# EAGLE schematic io-pack-3-3 (EAGLE 7.5.0)
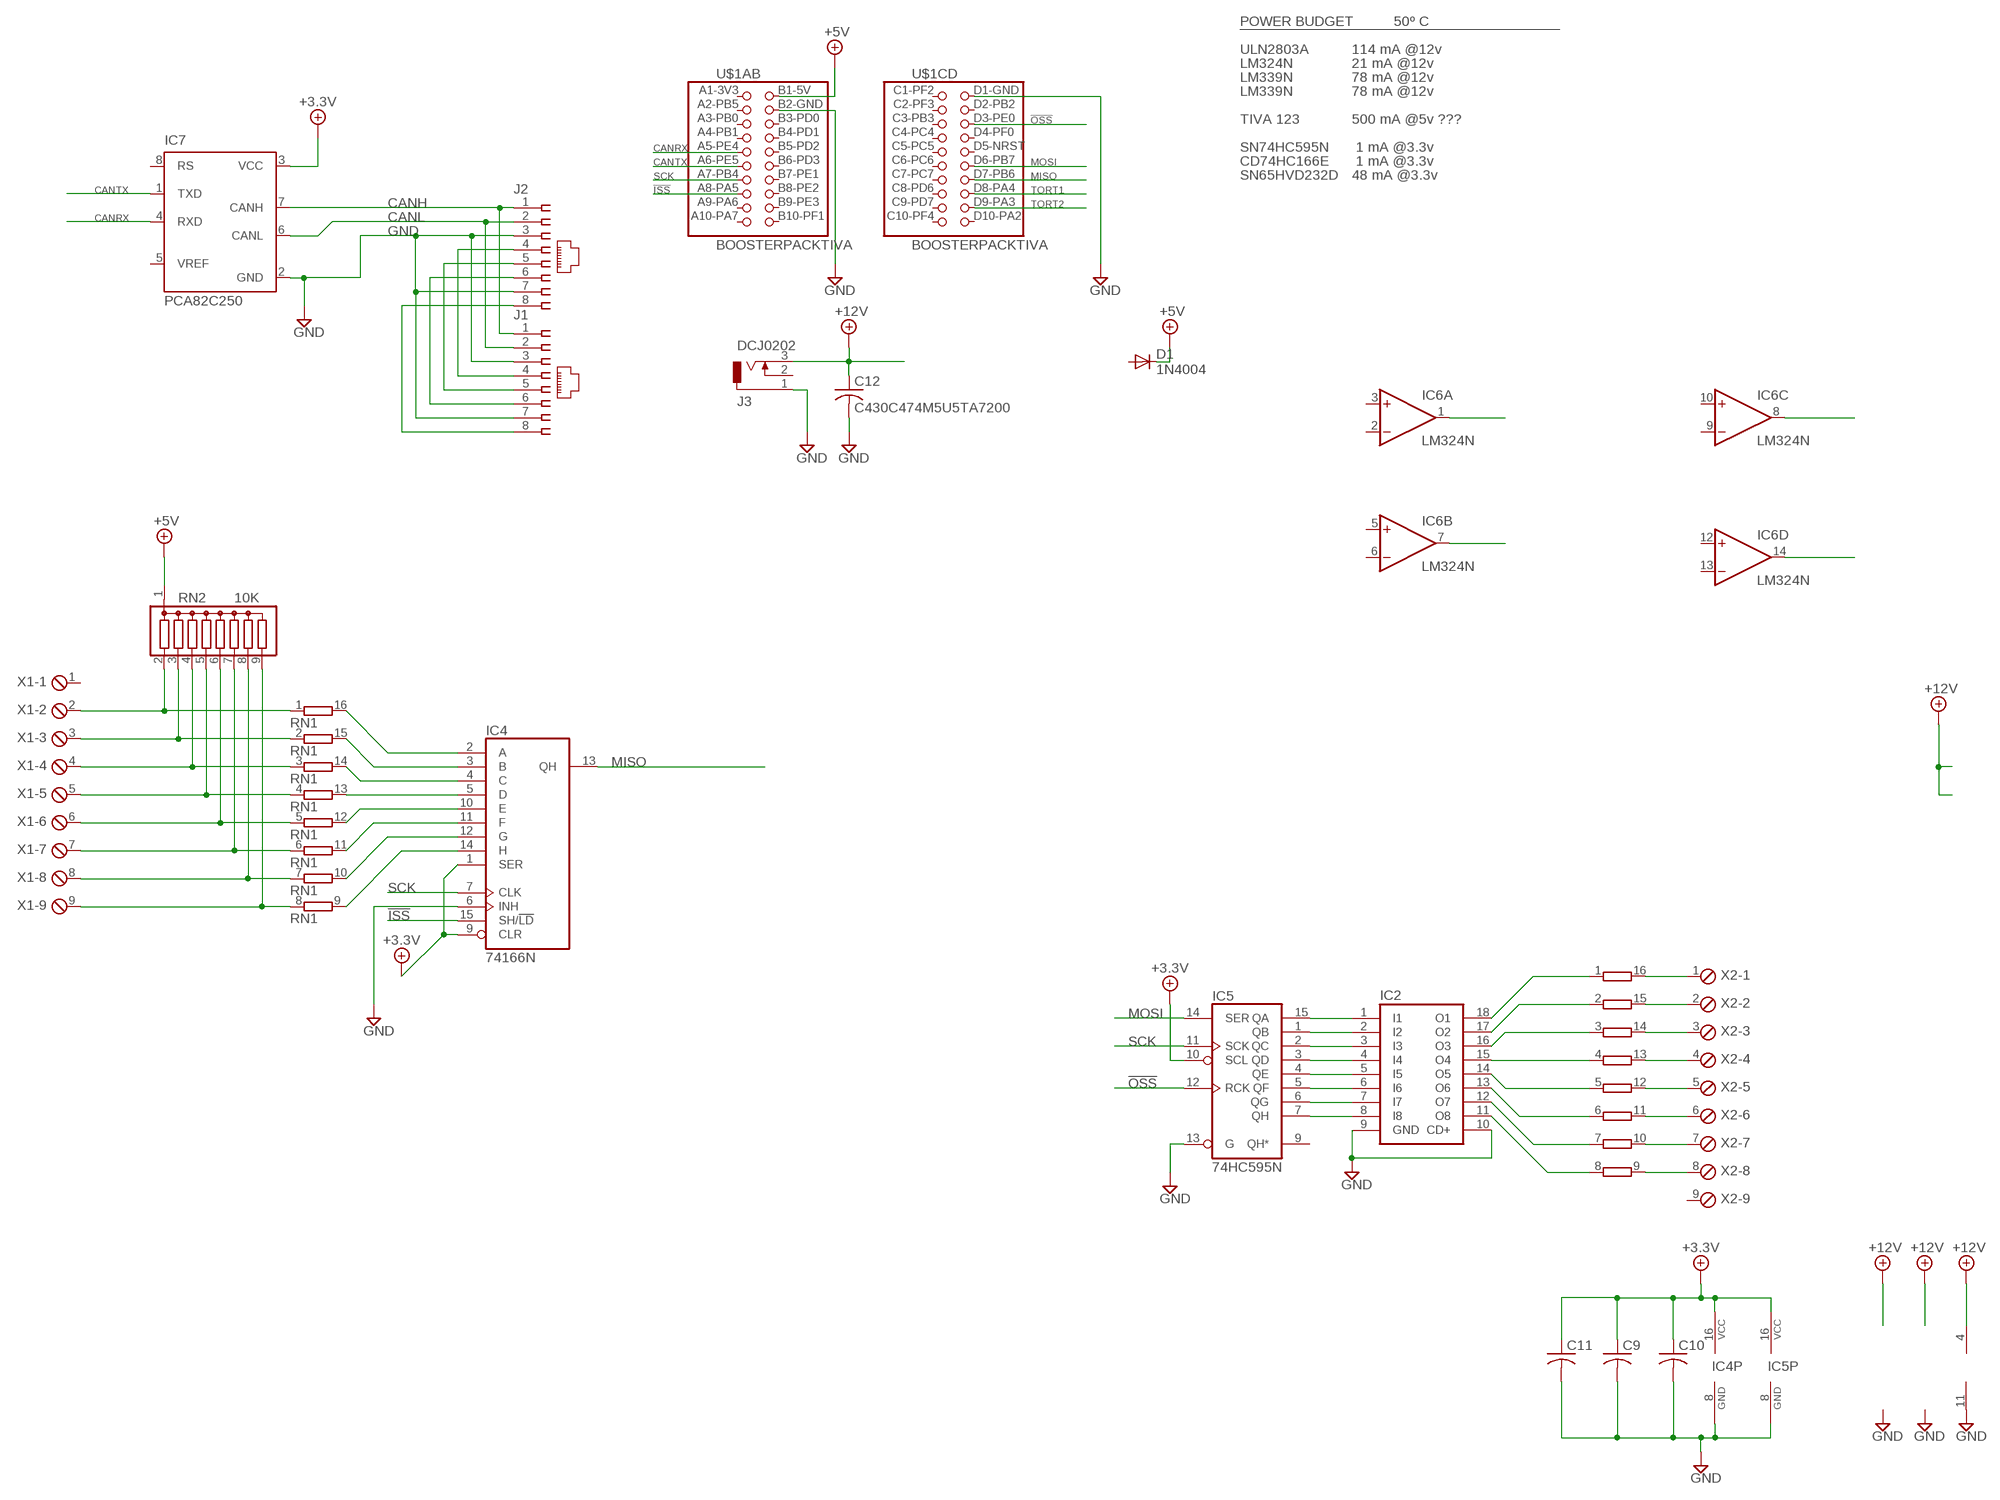
[diagram p0: schematic, sheet 1]

## Parts
C9  C-US050-025X075  [C050-025X075]
C10  C-US050-025X075  [C050-025X075]
C11  C-US050-025X075  [C050-025X075]
C12  C430C474M5U5TA7200  C-US075-032X103  [C075-032X103]
D1  1N4004  [DO41-10]
IC2  ULN2803A  [DIL18]
IC4  74166N  [DIL16]
IC5  74HC595N  74LS595N  [DIL16]
IC6  LM324N  [DIL14]
IC7  PCA82C250  [DIL08]
J1  555164-1  [555164-1]
J2  555164-1  [555164-1]
J3  DCJ0202  [DCJ0202]
RN1  8R-P  [DIL16]
RN2  10K  G08R  [SIL9]
RN3  8R-P  [DIL16]
U$1  BOOSTERPACKTIVA  [BOOSTERPACK-TIVA]
X1  MPT9  [9POL254]
X2  MPT9  [9POL254]

## Nets
!ISS: IC4.15(SH/!LD) U$1.A8-PA5
!OSS: IC5.12(RCK) U$1.D3-PE0
+3.3V: C9.1 C10.1 C11.1 IC4.1(SER) IC4.9(CLR) IC4.16(VCC) IC5.10(SCL) IC5.16(VCC) IC7.3(VCC)
+5V: D1.C RN2.1 U$1.B1-5V
+12V: C12.1 IC6.4(P:V+) J3.3
CANH: IC7.7(CANH) J1.1 J2.1
CANL: IC7.6(CANL) J1.2 J2.2
CANRX: IC7.4(RXD) U$1.A5-PE4
CANTX: IC7.1(TXD) U$1.A6-PE5
GND: C9.2 C10.2 C11.2 C12.2 IC2.9(GND) IC2.10(CD+) IC4.6(INH) IC4.8(GND) IC5.8(GND) IC5.13(G) IC6.11(P:V-) IC7.2(GND) J1.3 J1.7 J2.3 J2.7 J3.1 U$1.B2-GND U$1.D1-GND
MISO: IC4.13(QH) U$1.D7-PB6
MOSI: IC5.14(SER) U$1.D6-PB7
N$1: IC2.18(O1) RN3.1
N$2: IC2.17(O2) RN3.2
N$3: IC2.16(O3) RN3.3
N$4: J1.4 J2.4
N$5: J1.5 J2.5
N$6: J1.6 J2.6
N$7: IC2.15(O4) RN3.4
N$8: IC2.14(O5) RN3.5
N$9: IC2.13(O6) RN3.6
N$10: IC2.12(O7) RN3.7
N$11: IC2.11(O8) RN3.8
N$12: RN3.16 X2.1
N$13: RN3.15 X2.2
N$14: RN3.14 X2.3
N$15: RN3.13 X2.4
N$16: RN3.12 X2.5
N$17: RN3.11 X2.6
N$18: RN3.10 X2.7
N$19: RN3.9 X2.8
N$21: IC2.1(I1) IC5.15(QA)
N$22: IC2.2(I2) IC5.1(QB)
N$23: IC2.3(I3) IC5.2(QC)
N$24: IC2.4(I4) IC5.3(QD)
N$25: RN1.1 RN2.2 X1.2
N$26: RN1.2 RN2.3 X1.3
N$27: RN1.3 RN2.4 X1.4
N$28: RN1.4 RN2.5 X1.5
N$33: RN1.5 RN2.6 X1.6
N$34: RN1.6 RN2.7 X1.7
N$35: RN1.7 RN2.8 X1.8
N$36: RN1.8 RN2.9 X1.9
N$37: IC2.5(I5) IC5.4(QE)
N$38: IC2.6(I6) IC5.5(QF)
N$39: IC2.7(I7) IC5.6(QG)
N$40: IC2.8(I8) IC5.7(QH)
N$44: IC4.2(A) RN1.16
N$47: IC4.3(B) RN1.15
N$48: IC4.4(C) RN1.14
N$49: IC4.5(D) RN1.13
N$50: IC4.10(E) RN1.12
N$51: IC4.11(F) RN1.11
N$52: IC4.12(G) RN1.10
N$53: IC4.14(H) RN1.9
N$60: IC6.7(B:OUT)
N$63: IC6.14(D:OUT)
N$64: IC6.1(A:OUT)
N$65: IC6.8(C:OUT)
PWR_POS: J1.8 J2.8
SCK: IC4.7(CLK) IC5.11(SCK) U$1.A7-PB4
TORT1: U$1.D8-PA4
TORT2: U$1.D9-PA3
Unconnected: D1.A IC5.9(QH*) IC6.2(A:-IN) IC6.3(A:+IN) IC6.5(B:+IN) IC6.6(B:-IN) IC6.9(C:-IN) IC6.10(C:+IN) IC6.12(D:+IN) IC6.13(D:-IN) IC7.5(VREF) IC7.8(RS) J3.2 U$1.A1-3V3 U$1.A2-PB5 U$1.A3-PB0 U$1.A4-PB1 U$1.A9-PA6 U$1.A10-PA7 U$1.B3-PD0 U$1.B4-PD1 U$1.B5-PD2 U$1.B6-PD3 U$1.B7-PE1 U$1.B8-PE2 U$1.B9-PE3 U$1.B10-PF1 U$1.C1-PF2 U$1.C2-PF3 U$1.C3-PB3 U$1.C4-PC4 U$1.C5-PC5 U$1.C6-PC6 U$1.C7-PC7 U$1.C8-PD6 U$1.C9-PD7 U$1.C10-PF4 U$1.D2-PB2 U$1.D4-PF0 U$1.D5-NRST U$1.D10-PA2 X1.1 X2.9

## Notes on the sheet
- POWER BUDGET | 50º C
- ULN2803A | 114 mA @12v
- LM324N | 21 mA @12v
- LM339N | 78 mA @12v
- LM339N | 78 mA @12v
- TIVA 123 | 500 mA @5v ???
- SN74HC595N | 1 mA @3.3v
- CD74HC166E | 1 mA @3.3v
- SN65HVD232D | 48 mA @3.3v

## Library data of the parts
C9-C12 = rcl:C-US: CAPACITOR, American symbol
D1 = diode:1N4004: DIODE general purpose rectifier, 1 A
IC2 = uln-udn:ULN2803A: DRIVER ARRAY
IC4 = 74xx-us:74*166: 8-bit parallel load SHIFT REGISTER
IC5 = 74xx-us:74*595: 8-bit SHIFT REGISTER, output latch
IC6 = linear:LM324: OP AMP
IC7 = micro-philips:PCA82C250: CAN CONTROLLER INTERFACE; OC_FARNELL: 3692358; OC_NEWARK: unknown
J1 J2 = con-amp:555164-1: AMP connector
J3 = con-jack:DCJ0202: DC POWER JACK Source: DCJ0202.pdf; OC_FARNELL: unknown; OC_NEWARK: unknown
RN1 RN3 = resistor-dil:8R-P: DIL RESISTOR; OC_FARNELL: unknown; OC_NEWARK: unknown
RN2 = resistor-sil:G08R: SIL RESISTOR; OC_FARNELL: unknown; OC_NEWARK: unknown
U$1 = trainlib:BOOSTERPACK
X1 X2 = con-phoenix-254:MPT9: PHOENIX CONNECTOR; OC_FARNELL: unknown; OC_NEWARK: unknown